# Altium schematic sheet 电源.SchDoc
size A4
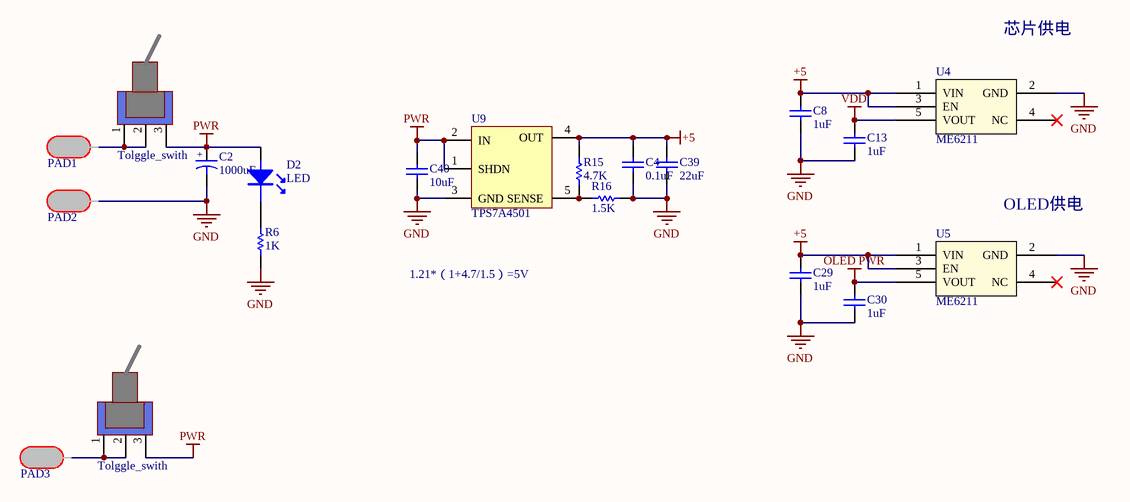
[diagram p0: 电源.SchDoc]

## Parts
C2  1000uF  [CAP 10 x 12]
C4  0.1uF  [0603_C]
C8  1uF  [0805_c]
C13  1uF  [0805_c]
C29  1uF  [0805_c]
C30  1uF  [0805_c]
C39  22uF  [0805_c]
C40  10uF  [0805_c]
D2  LED  [0603_LED]
Energy1  Tolggle_swith  [TOGGLE SWICH STAND]
Energy2  Tolggle_swith  [TOGGLE SWICH STAND]
PAD1  PAD  [BIG PAD]  (value not drawn)
PAD2  PAD  [BIG PAD]  (value not drawn)
PAD3  PAD  [BIG PAD]  (value not drawn)
R6  1K  [R0603]
R15  4.7K  [R0603]
R16  1.5K  [R0603]
U4  ME6211  [SOT23-5]
U5  ME6211  [SOT23-5]
U9  TPS7A4501  [SOT-6]

## Nets
+5: C4.2 C8.2 C29.2 C39.2 R15.2 U4.1(VIN) U4.3(EN) U5.1(VIN) U5.3(EN) U9.4(OUT)
GND: C2.2 C4.1 C8.1 C13.1 C29.1 C30.1 C39.1 C40.1 PAD2.1 R6.1 R16.2 U4.2(GND) U5.2(GND) U9.3(GND)
OLED PWR: C30.2 U5.5(VOUT)
PWR: C2.1 C40.2 D2.1(A) Energy1.3 Energy2.3 U9.1(SHDN) U9.2(IN)
VDD: C13.2 U4.5(VOUT)
NetD2_2: D2.2(K) R6.2
NetEnergy1_1: Energy1.1 Energy1.2 PAD1.1
NetEnergy2_1: Energy2.1 Energy2.2 PAD3.1
NetR15_1: R15.1 R16.1 U9.5(SENSE)

Not connected (* = marked no-connect by the designer): U4 4(NC)*; U5 4(NC)*

## Notes on the sheet
- 芯片供电
- (near U5) OLED供电
- 1.21*（1+4.7/1.5）=5V
- (in symbol Cap_polar) +

## Library data of the parts
C2 = Cap_polar
C4 C8 C13 C29 C30 C39 C40 = CAP: Capacitor; Value: 104; Published: 8-Jun-2000; LatestRevisionDate: 17-Jul-2002; LatestRevisionNote: Re-released for DXP Platform.; PackageReference: RAD-0.3; Publisher: Altium Limited
D2 = LED: LED 发光二极管
R6 = RES: Resistor; Published: 8-Jun-2000; Revision: July-2002: Re-released for DXP Platform.; Publisher: Altium Limited; Value: 1K
R15 R16 = RES: Resistor; Value: 1K; Published: 8-Jun-2000; Revision: July-2002: Re-released for DXP Platform.; Publisher: Altium Limited
U4 U5 = ADP150AUJZ-1_8-R: 9uVRMS 150mA LDO; RefDes: RefDes; Type: Type; Value: Value
U9 = TL1963A